# Altium schematic sheet Driver Morpheus v4.0 PONTE H.SchDoc
size A4
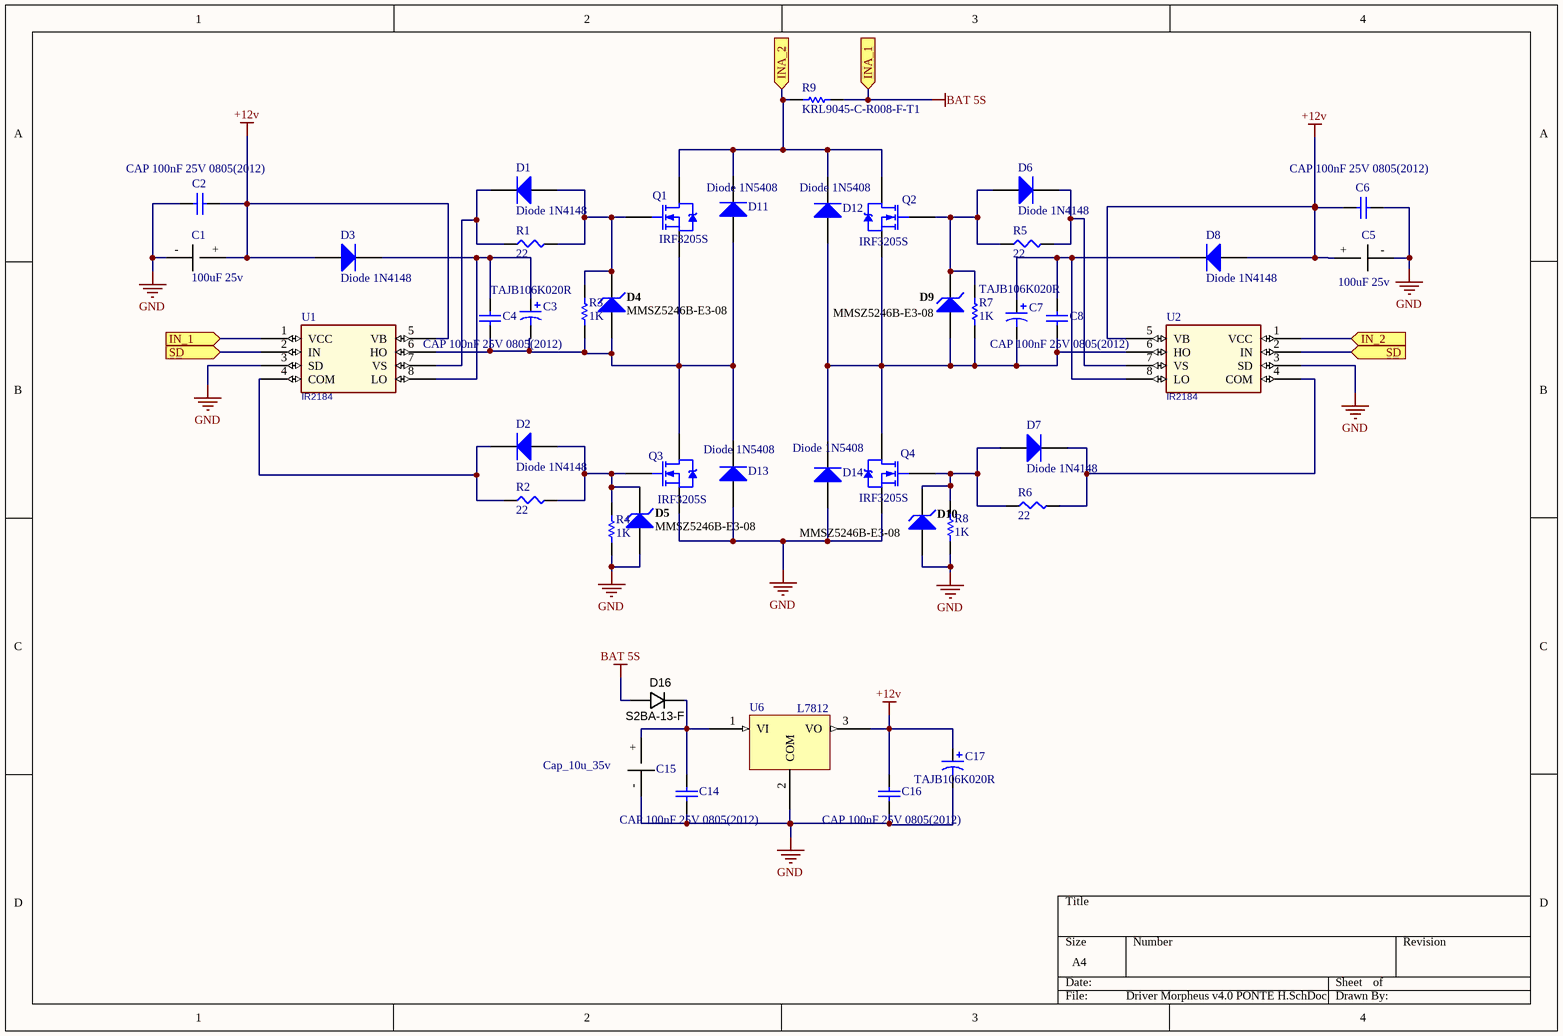
[diagram p0: Driver Morpheus v4.0 PONTE H.SchDoc]

## Parts
C1  100uF 25v  [CAP_100u_25v_Tantalum]
C2  CAP 100nF 25V 0805(2012)  [CAPC0805(2012)145_M]
C3  TAJB106K020R  [AVX-CAPC3528_V]
C4  CAP 100nF 25V 0805(2012)  [CAPC0805(2012)145_M]
C5  100uF 25v  [CAP_100u_25v_Tantalum]
C6  CAP 100nF 25V 0805(2012)  [CAPC0805(2012)145_M]
C7  TAJB106K020R  [AVX-CAPC3528_V]
C8  CAP 100nF 25V 0805(2012)  [CAPC0805(2012)145_M]
C14  CAP 100nF 25V 0805(2012)  [CAPC0805(2012)145_M]
C15  Cap_10u_35v  [CAP_100u_25v_Tantalum]
C16  CAP 100nF 25V 0805(2012)  [CAPC0805(2012)145_M]
C17  TAJB106K020R  [AVX-CAPC3528_V]
D1  Diode 1N4148  [SOD123]
D2  Diode 1N4148  [SOD123]
D3  Diode 1N4148  [SOD123]
D4  MMSZ5246B-E3-08  [VISH-SOD-123-2_V]
D5  MMSZ5246B-E3-08  [VISH-SOD-123-2_V]
D6  Diode 1N4148  [SOD123]
D7  Diode 1N4148  [SOD123]
D8  Diode 1N4148  [SOD123]
D9  MMSZ5246B-E3-08  [VISH-SOD-123-2_V]
D10  MMSZ5246B-E3-08  [VISH-SOD-123-2_V]
D11  Diode 1N5408  [DO-201AD]
D12  Diode 1N5408  [DO-201AD]
D13  Diode 1N5408  [DO-201AD]
D14  Diode 1N5408  [DO-201AD]
D16  Manufacturer Part Number 1: S2BA-13-F  [DO-214AC]  (hidden comment: 100V; 1.5A)
Q1  IRF3205S  [D2PAK_N]
Q2  IRF3205S  [D2PAK_N]
Q3  IRF3205S  [D2PAK_N]
Q4  IRF3205S  [D2PAK_N]
R1  22  [SMD-0603-RES]
R2  22  [SMD-0603-RES]
R3  value 1K  [RES-0402]  (hidden comment: RC0402JR-071KL)
R4  value 1K  [RES-0402]  (hidden comment: RC0402JR-071KL)
R5  22  [SMD-0603-RES]
R6  22  [SMD-0603-RES]
R7  value 1K  [RES-0402]  (hidden comment: RC0402JR-071KL)
R8  value 1K  [RES-0402]  (hidden comment: RC0402JR-071KL)
R9  KRL9045-C-R008-F-T1  [8m OHM 4W]
U1  IR2184  [SOIC127P600X175-8AN]
U2  IR2184  [SOIC127P600X175-8AN]
U6  L7812  [D2PAK-3]

## Ports
IN_1 (in), IN_2 (in), INA_1 (in), INA_2 (in), SD (in)

## Nets
+12v: C1.+ C2.2 C5.+ C6.2 C16.2 C17.1 D3.1(A) D8.1(A) U1.5(VB) U2.5(VB) U6.3(VO)
BAT 5S: D16.A R9.1 ; port INA_1
GND: C1.- C2.1 C5.- C6.1 C14.1 C15.- C16.1 C17.2 D5.1(A) D10.1(A) D13.1(A) D14.1(A) Q3.3(S) Q4.3(S) R4.1 R8.1 U1.3(SD) U2.3(SD) U6.2(COM)
IN_1: U1.1(VCC) ; port IN_1
IN_2: U2.1(VCC) ; port IN_2
INA_2: D11.2(K) D12.2(K) Q1.2(D) Q2.2(D) R9.2 ; port INA_2
SD: U1.2(IN) U2.2(IN) ; port SD
NetC3_1: C3.1 C4.2 D3.2(K) U1.8(LO)
NetC3_2: C3.2 C4.1 D4.1(A) D11.1(A) D13.2(K) Q1.3(S) Q3.2(D) R3.1 U1.6(HO)
NetC7_1: C7.1 C8.2 D8.2(K) U2.8(LO)
NetC7_2: C7.2 C8.1 D9.1(A) D12.1(A) D14.2(K) Q2.3(S) Q4.2(D) R7.1 U2.6(HO)
NetC14_2: C14.2 C15.+ D16.K U6.1(VI)
NetD1_1: D1.1(A) D4.2(K) Q1.1(G) R1.2 R3.2
NetD1_2: D1.2(K) R1.1 U1.7(VS)
NetD2_1: D2.1(A) D5.2(K) Q3.1(G) R2.2 R4.2
NetD2_2: D2.2(K) R2.1 U1.4(COM)
NetD6_1: D6.1(A) D9.2(K) Q2.1(G) R5.1 R7.2
NetD6_2: D6.2(K) R5.2 U2.7(VS)
NetD7_1: D7.1(A) D10.2(K) Q4.1(G) R6.1 R8.2
NetD7_2: D7.2(K) R6.2 U2.4(COM)

## Library data of the parts
C1 C5 = Cap_100u_25v: Cap Tântalo
C2 C4 C6 C8 C14 C16 = CMP-1036-04408-1: CAP 100nF 25V ±5% 0805 (2012 Metric) Thickness 1.45mm SMD; Case-Metric: 2012; Case-EIA: 0805; Tolerance: Â±5%; Value: 100nF; Rated Voltage: 25 V; Max Thickness: 1.45 mm; Technology: SMT
C3 C7 C17 = CMP-0279-00001-1: Capacitor, Tantalum, 10uF 10% 20V MCCT-B (3528); Manufacturer: AVX; Polarity: Polarized; PartNumber: TAJB106K020R; PackageDescription: 2-Pin SMT Capacitor, 3.5 x 2.8 mm Body; ComponentLink1URL: http://www.avx.com/; PackageReference: CAPC3528; ComponentLink2Description: Datasheet; Capacitance: 10uF; Technology: Tantalum; ComponentLink2URL: http://www.avx.com/docs/Catalogs/taj.pdf; Tolerance: 10%; ComponentLink1Description: Manufacturer URL; Rated Voltage: 20V; DatasheetVersion: Jun-13; Mounting Technology: Surface Mount
D1-D3 D6-D8 = Diode 1N4148: High Conductance Fast Diode; Published: 8-Jun-2000; LatestRevisionDate: 17-Jul-2002; LatestRevisionNote: Re-released for DXP Platform.; DatasheetVersion: 1997; PackageReference: DO-35; Publisher: Altium Limited; PackageDescription: Diode, Axial; Body 3.8 x 1.9 mm (LxDia. max), Lead Dia. 0.53 mm (max); Code_JEDEC: DO-204-AH; ComponentLink1Description: Manufacturer Link; ComponentLink1URL: http://www.fairchildsemi.com/; ComponentLink2Description: Datasheet; ComponentLink2URL: http://www.fairchildsemi.com/ds/1N%2F1N4148.pdf
D4 D5 D9 D10 = CMP-0931-00032-1: Small Signal Zener Diode, 16 V +/- 5%, -55 to 155 degC, 2-Pin SOD-123, RoHS, Tape and Reel; Manufacturer: Vishay Semiconductor; Test Current (IZT1) (mA): 7.8; Zener Impedance (IZT1) (Max.) (Ohm): 17; Int. Construction: Single; Tolerance: +/- 5%; Power Dissipation (mW): 500; Zener Voltage (NOM.) (V): 16; ComponentLink1URL: http://www.vishay.com/; PackageReference: SOD-123-2; PartNumber: MMSZ5246B-E3-08; ComponentLink2Description: Datasheet; Operating Temperature: -55 to 150 degC; PackageDescription: 2-Pin SMD, Body 2.7 x 1.55 mm, Height 1.35 mm; ComponentLink2URL: http://www.vishay.com/docs/85774/mmsz5225.pdf; DatasheetVersion: Rev. 1.9; RoHS: TRUE; Packing: Tape and Reel; ComponentLink1Description: Manufacturer URL; Mounting Technology: Surface Mount; PackageVersion: Rev. 1.9; ComponentLink3URL: http://www.vishay.com/docs/85774/mmsz5225.pdf; ComponentLink3Description: Package Specification
D11-D14 = Diode 1N5408: 3 Amp Medium Power Silicon Rectifier Diode; Published: 8-Jun-2000; LatestRevisionDate: 17-Jul-2002; LatestRevisionNote: Re-released for DXP Platform.; DatasheetVersion: Aug-1984; PackageReference: DO-201AD; Publisher: Altium Limited; PackageDescription: Diode, Axial; Body 9.5 x 5.3 mm (LxDia. max), Lead Dia. 1.32 mm (max); ComponentLink1Description: Manufacturer Link; ComponentLink1URL: http://www.irf.com/
D16 = DIODE_100V_1.5A_SMA: Diode SMD 100V 1.5A SMA; Manufacturer 1: Diodes Inc; Material: Si; Diode Type: Standard; Value: Vf = 1.15V @ 1.5A (Max); SCDType: source; Package / Case: DO-214AC, SMA; Ratings: 100V; 1.5A; Supplier 1: Digi-Key; Supplier Part Number 1: S2BA-FDICT-ND
Q1-Q4 = IRF3205S: HEXFET Power MOSFET; Published: 8-Jun-2000; LatestRevisionDate: 20-Nov-2009; LatestRevisionNote: IPC-7351 Footprint Added.; DatasheetVersion: Aug-1997; PackageReference: D2PAK; Publisher: Altium Limited; PackageDescription: 3-Pin Transistor Outline Package 2.54 mm Pitch, 15.1 mm Lead Span; ComponentLink1Description: Manufacturer Link; ComponentLink1URL: http://www.irf.com/; ComponentLink2Description: Datasheet; ComponentLink2URL: http://www.irf.com/product-info/datasheets/data/irf3205s.pdf
R1 R2 R5 R6 = ERJ-3EKF22R0V: RES SMD 22 OHM 1% 1/10W 0603; Manufacturer: Panasonic Electronic Components; Factory Stock: 0; Unit Price (USD): 0.00379; @ qty: 1500; Minimum Quantity: 1; Power (Watts): 0.1W, 1/10W; Temperature Coefficient: ±100ppm/°C; Part Number: ERJ-3EKF22R0V; Datasheets: http://industrial.panasonic.com/www-cgi/jvcr13pz.cgi?E+PZ+3+AOA0002+ERJ3EKF22R0V+7+WW; Image: //media.digikey.com/Photos/Panasonic%20Photos/MFG_ERJ-P6W%20Series.jpg; Digi-Key Part Number: P22.0HCT-ND; Quantity Available: 100321; Packaging: Cut Tape (CT); Series: ERJ; Part Status: Active; Value: 22; Tolerance: ±1%; Composition: Thick Film; Features: Automotive AEC-Q200; Operating Temperature: -55°C ~ 155°C; Package / Case: 0603 (1608 Metric); Supplier Device Package: 0603; Size / Dimension: 0.063" L x 0.031" W (1.60mm x 0.80mm); Height - Seated (Max): 0.022" (0.55mm); Number of Terminations: 2; Failure Rate: -
R3 R4 R7 R8 = RES 1K 0402: RES SMD 1K OHM 5% 1/16W 0402
R9 = CMP-1666-00018-2: Chip Resistor, 0.008 Ohm, +/- 1%, 4 W; PartNumber: WSLP12061L000FEA; Resistance: 0.001 Ohm; RoHSCompliant: True; Mounting Technology: Surface Mount; ComponentLink1URL: http://www.vishay.com/; Min Operating Temperature: -65 degC; Height: 0.635 mm; ComponentLink2URL: http://www.farnell.com/datasheets/2049155.pdf; Length: 3.2 mm; ComponentLink2Description: Datasheet; ComponentLink1Description: Manufacturer URL; DatasheetVersion: 04/2015; Case Code (Imperial): 1206; Max Operating Temperature: 170 degC; Packaging: Tape and Reel; Tolerance: 1%; Case/Package: 1206; Width: 1.6 mm; REACH SVHC: Unknown; PackageDescription: 2-Pin Surface Mount Device, Body 3.2 x 1.6 mm; Case Code (Metric): 3216
U1 U2 = IR2184: PSpiceTemplate: X^@REFDES %VCC %IN %SD %COM %VB %HO %VS %LO @MODEL PARAMS:  ?CDELAY|CDELAY=@CDELAY||CDELAY=50N| ?RDELAY|RDELAY=@RDELAY||RDELAY=50| ?T1|T1=@T1||T1=-40| ?T2|T2=@T2||T2=25| ?T3|T3=@T3||T3=125| ?V1|V1=@V1||V1=10| ?V2|V2=@V2||V2=15| ?V3|V3=@V3||V3=20| ?TOFFT1|TOFFT1=@TOFFT1||TOFFT1=270N| ?TOFFT2|TOFFT2=@TOFFT2||TOFFT2=270N| ?TOFFT3|TOFFT3=@TOFFT3||TOFFT3=270N| ?TOFFV1|TOFFV1=@TOFFV1||TOFFV1=270N| ?TOFFV2|TOFFV2=@TOFFV2||TOFFV2=270N| ?TOFFV3|TOFFV3=@TOFFV3||TOFFV3=270N| ?TONT1|TONT1=@TONT1||TONT1=210N| ?TONT2|TONT2=@TONT2||TONT2=210N| ?TONT3|TONT3=@TONT3||TONT3=210N| ?TONV1|TONV1=@TONV1||TONV1=210N| ?TONV2|TONV2=@TONV2||TONV2=210N| ?TONV3|TONV3=@TONV3||TONV3=210N|; TONV3: 210N; TOFFV3: 270N; V3: 20; V2: 15; V1: 10; T3: 125; T2: 25; T1: -40; RDELAY: 50; CDELAY: 50N; TONV2: 210N; TONV1: 210N; TONT3: 210N; TONT2: 210N; TONT1: 210N; TOFFV2: 270N; TOFFV1: 270N; TOFFT3: 270N; TOFFT2: 270N; TOFFT1: 270N
U6 = LM7812